# EAGLE schematic 02A-005 Input Switch (EAGLE 6.3)
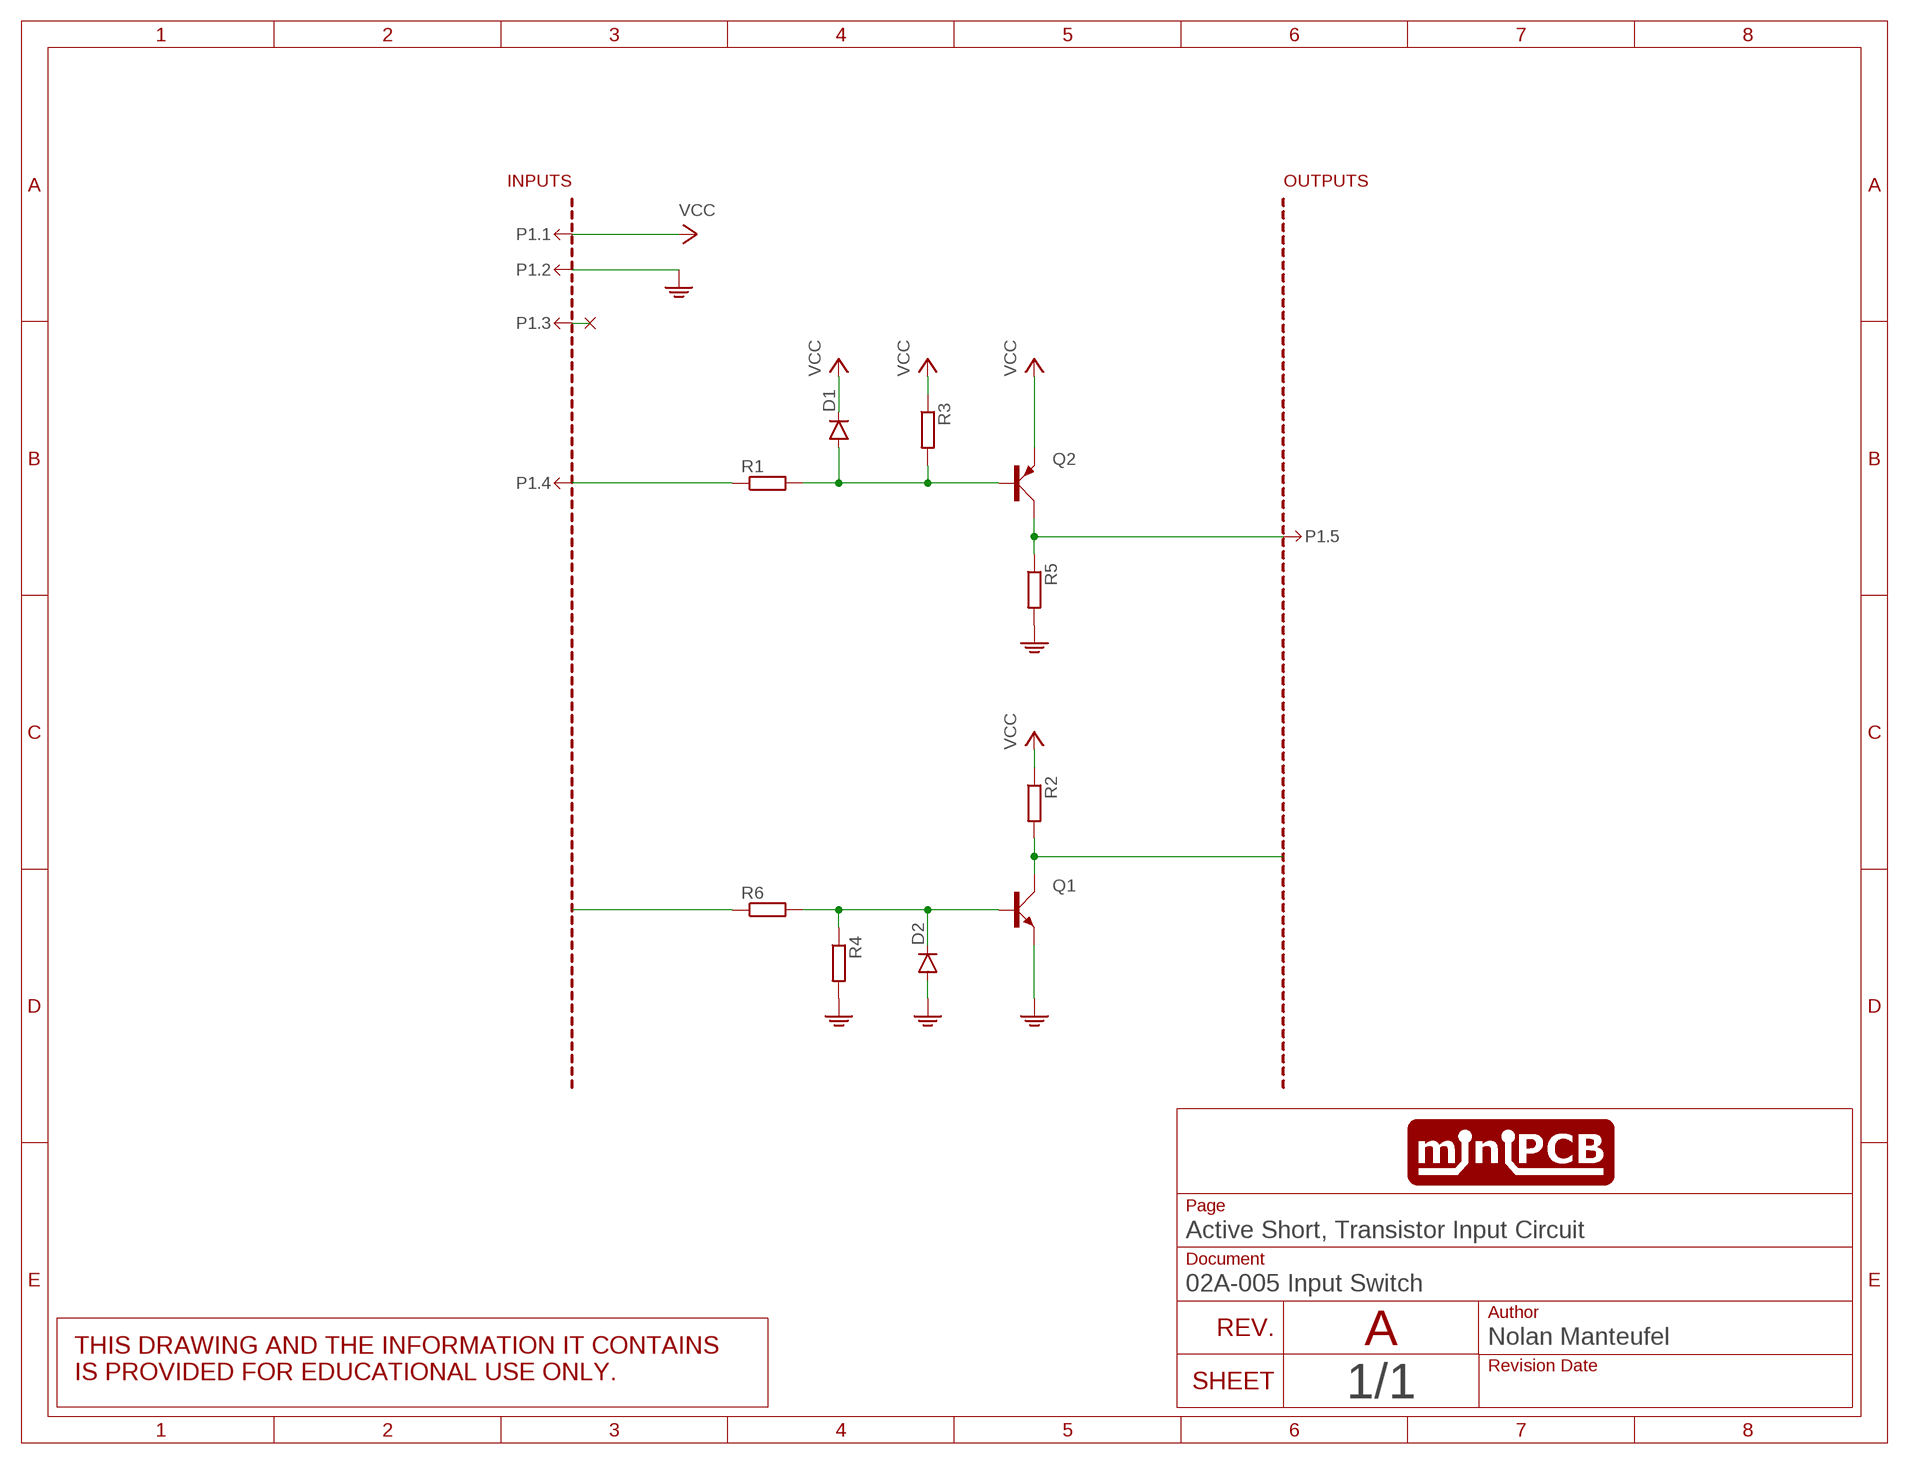
[diagram p0: schematic, sheet 1]

## Parts
D1  DIODE-SOD80C  [SOD80C]
D2  DIODE-SOD80C  [SOD80C]
P1.  MINIPCB_4INCH  [PCB_5]
Q1  BJT_NPNBEC  [SOT23]
Q2  BJT_PNPBEC  [SOT23]
R1  R-EU_R0805  [R0805]
R2  R-EU_R0805  [R0805]
R3  R-EU_R0805  [R0805]
R4  R-EU_R0805  [R0805]
R5  R-EU_R0805  [R0805]
R6  R-EU_R0805  [R0805]

## Nets
GND: D2.A P1..1 Q1.2(E) R4.2 R5.2
INPUT: P1..4 R1.1
N$1: D1.A Q2.1(B) R1.2 R3.2
N$2: P1..3
N$3: Q1.3(C) R2.2
N$4: D2.C Q1.1(B) R4.1 R6.2
N$5: P1..5 Q2.3(C) R5.1
N$6: R6.1
VCC: D1.C P1..2 Q2.2(E) R2.1 R3.1

## Notes on the sheet
- A

## Library data of the parts
D1 D2 = nolan:DIODE-: DIODE
P1. = nolan:MINIPCB_4INCH
Q1 = nolan:BJT_NPN
Q2 = nolan:BJT_PNP
R1-R6 = nolan:R-EU_: RESISTOR, European symbol